# EasyEDA Pro project TJMakes_OLED.eprj

# Schematic schematic1
Create Date: 2024-02-23; Page Name: P1; Project Name: TJMakes_OLED; Schematic Name: schematic1; Update Date: 2024-02-26; Company: EasyEDA.com; Drawn: EasyEDA; Page Size: A4; Part Number: JLCPCB-002; Reviewed: EasyEDA; Version: V0.1
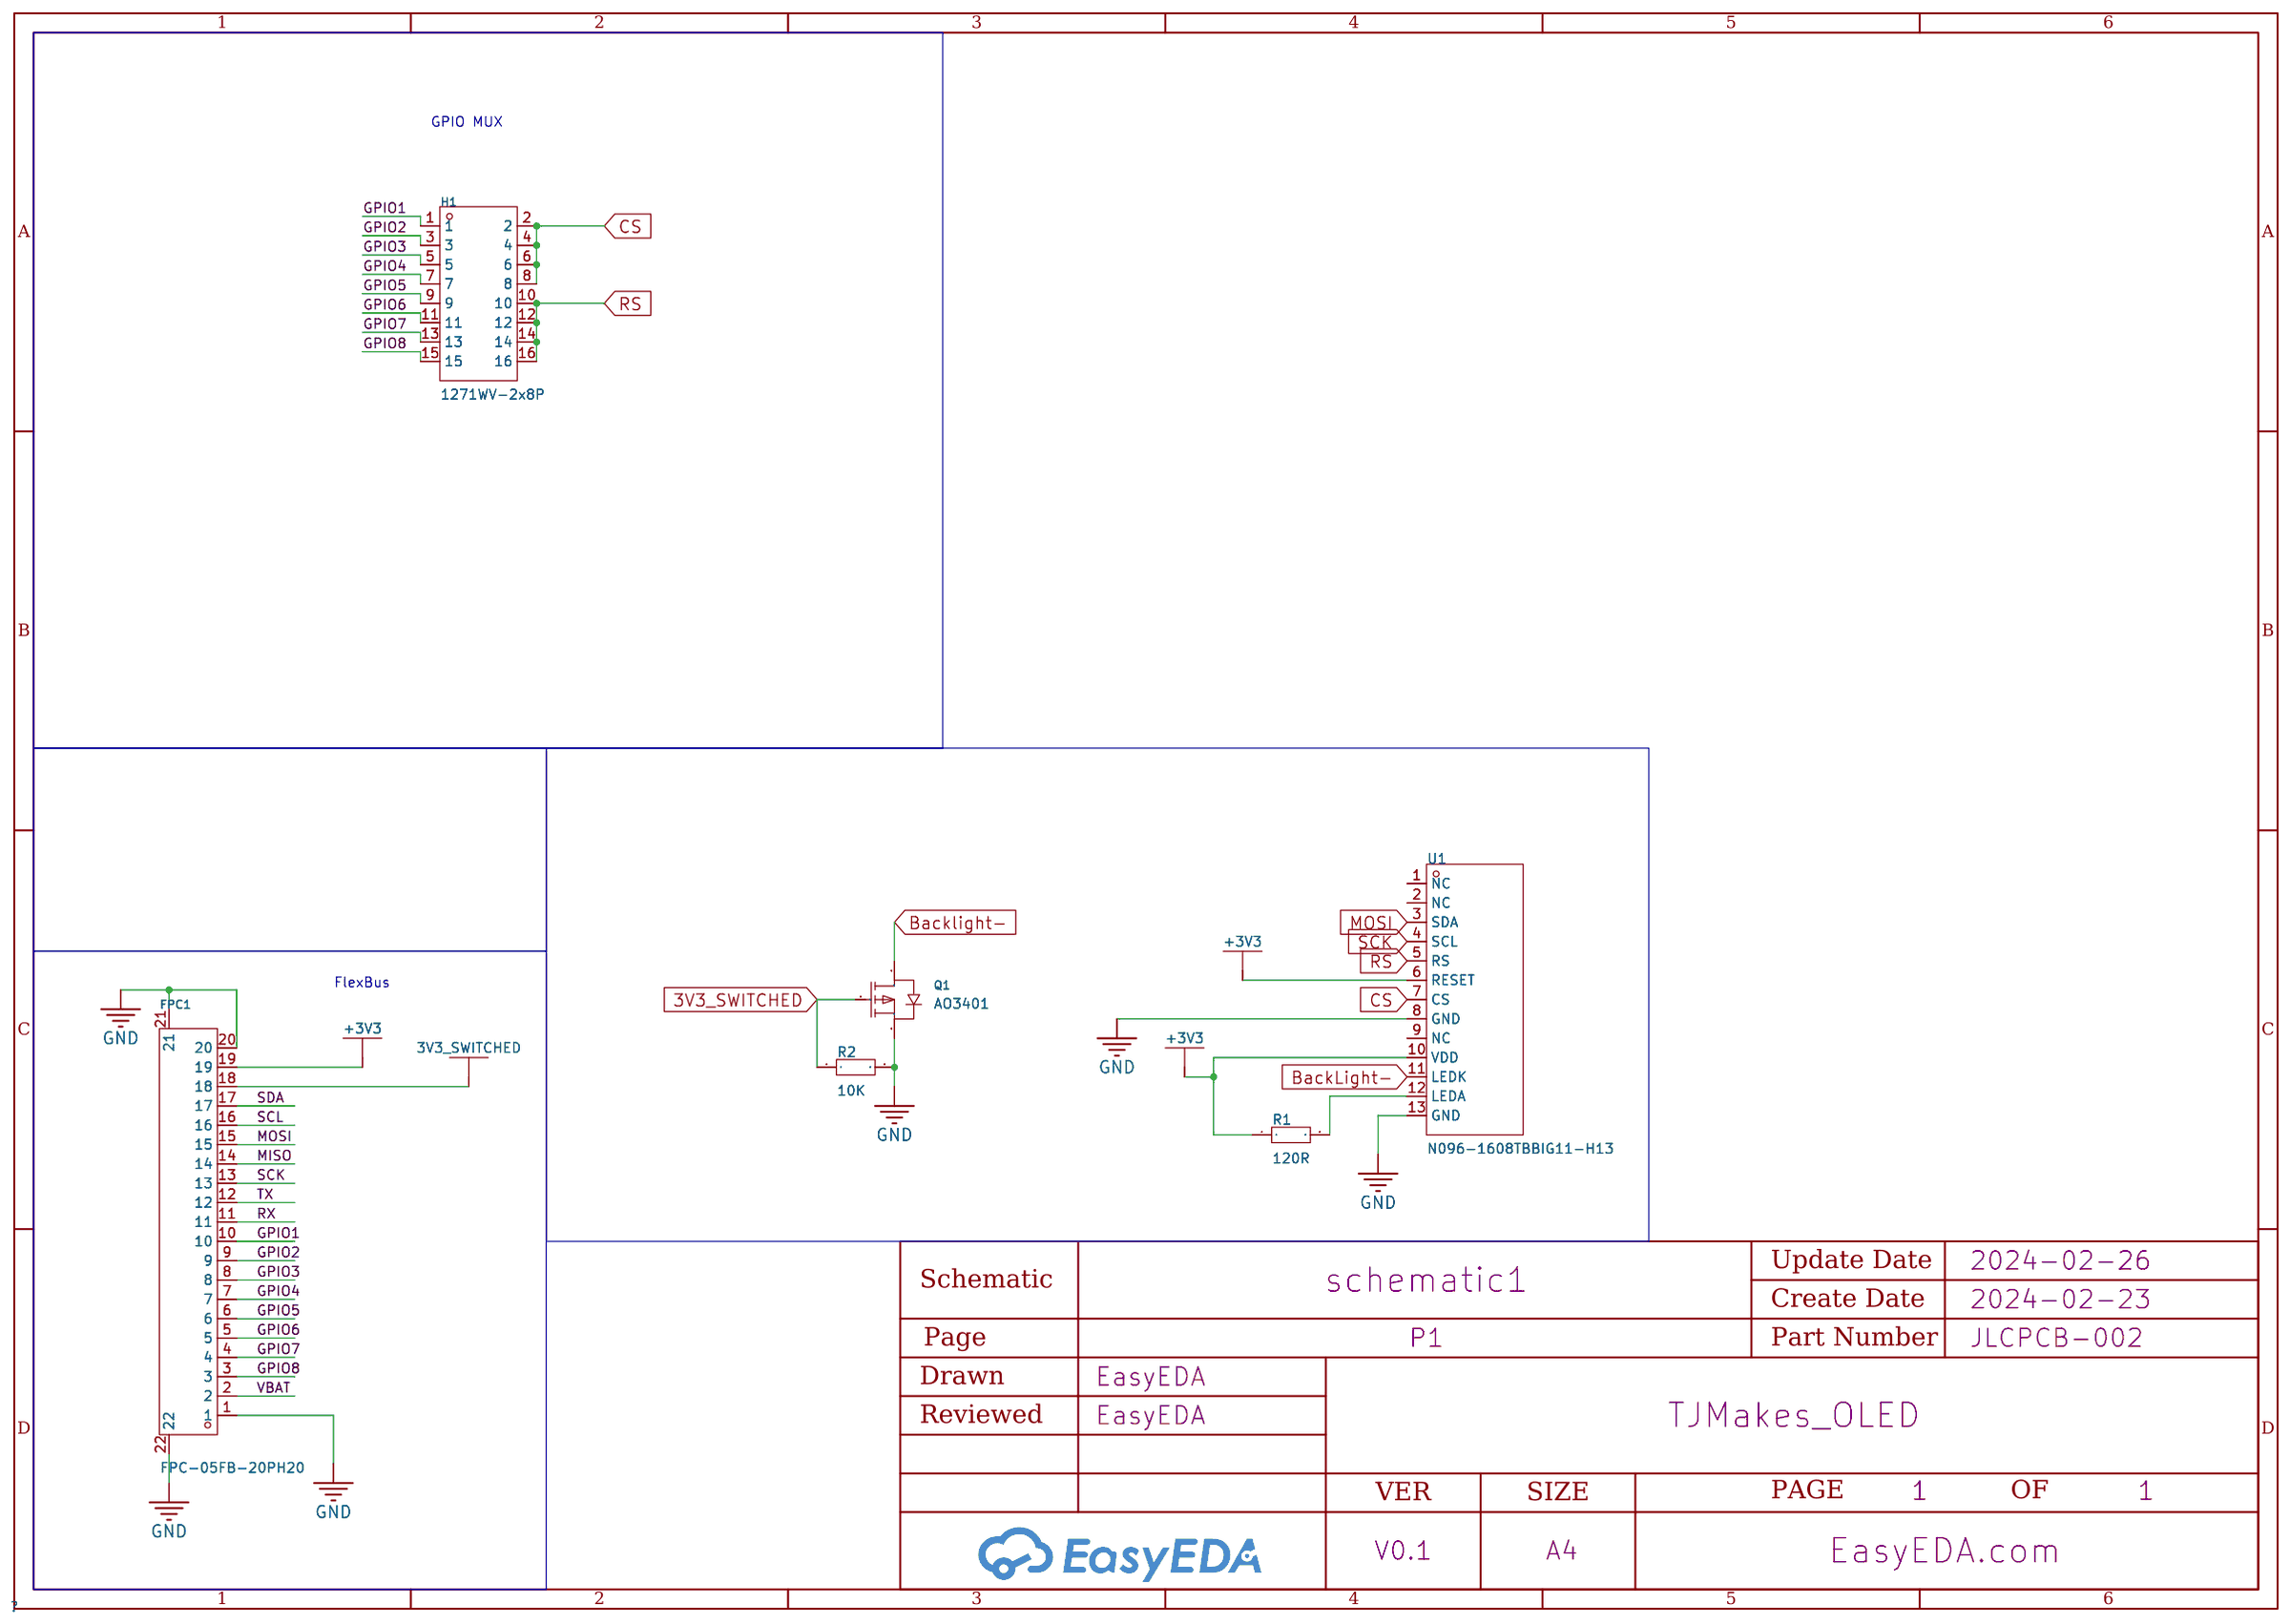
[diagram p0: schematic sheet]

## Parts
FPC1  FPC-05FB-20PH20  [FPC-SMD_20P-P0.50_FPC-05FB-20PH20]
H1  1271WV-2x8P  [HDR-TH_16P-P1.27-V-M-R2-C8-S1.27]
Q1  AO3401  [SOT-23-3_L2.9-W1.4-P1.90-LS2.6-BR]
R1  120R  [R0603]
R2  10K  [R0603]
U1  N096-1608TBBIG11-H13  [OLED-SMD_ST7735S]

## Library data of the parts
FPC1 = FPC-05FB-20PH20: Pitch:0.5mm Number of Contacts:20P Locking Feature:Clamshell FFC, FCB Thickness:0.3mm FFC, FCB Thickness:0.3mm Contact Type:Double-sided contacts/up and down connection Mounting Type:Surface Mount Height Above Board:2mm Operating Temperature Range:-25℃~+8; LCSC Part Name: 间距:0.5mm P数:20P 翻盖式 双侧触点/上下接; Supplier Part: C2856830; Manufacturer: XUNPU(讯普); Supplier Footprint: SMD,P=0.5mm,卧贴; JLCPCB Part Class: Extended Part; Datasheet: https://atta.szlcsc.com/upload/public/pdf/source/20210922/C2856830_32DC95BE77527398880E7D75F765EF2A.pdf; Supplier: LCSC; Pitch: 0.5mm; Number of Contacts: 20P; Locking Feature: Clamshell; FFC, FCB Thickness: 0.3mm; Contact Type: Double-sided contacts/up and down connection; Mounting Type: Surface Mount; Height Above Board: 2mm; Operating Temperature Range: -25℃~+85℃
H1 = KH-1.27PH180-2X8P-L7.2: Pin Structure:2x8P Pitch:1.27mm Row Spacing:1.27mm Circluar Pins/Square Pins:Square Pins Mounting Type:Straight Number of Rows:双排 Number of Pins:16P Current Rating (Max):1A Voltage Rating (Max):- Length of Mating Pin:3.9mm Insulation Height:1mm Length of; LCSC Part Name: 间距:1.27mm 2x8P 直插 方针; Supplier Part: C7470092; Manufacturer: kinghelm(金航标); Supplier Footprint: 插件,P=1.27mm; JLCPCB Part Class: Extended Part; Datasheet: https://atta.szlcsc.com/upload/public/pdf/source/20211228/40BBFCDE63818F8CDD890F8C15594070.pdf; Supplier: LCSC; Pin Structure: 2x8P; Pitch: 1.27mm; Row Spacing: 1.27mm; Circluar Pins/Square Pins: Square Pins; Mounting Type: Straight; Number of Rows: 双排; Number of Pins: 16P; Current Rating (Max): 1A; Length of Mating Pin: 3.9mm; Insulation Height: 1mm; Length of End Connection Pin: 2.3mm; Operating Temperature Range: -40℃~+105℃
Q1 = AO3401_C727156: Type: Drain Source Voltage (Vdss): Continuous Drain Current (Id): Power Dissipation (Pd): Drain Source On Resistance (RDS(on)@Vgs,Id):65mΩ@10V,4.2A Gate Threshold Voltage (Vgs(th)@Id):1.3V@250uA Total Gate Charge (Qg@Vgs):- Input Capacitance (Ciss@Vds):-; LCSC Part Name: P沟道 耐压:30V 电流:4.2A; Supplier Part: C727156; Manufacturer: TWGMC(台湾迪嘉); Supplier Footprint: SOT-23; JLCPCB Part Class: Extended Part; Datasheet: https://atta.szlcsc.com/upload/public/pdf/source/20200827/C727156_6E081BBEEFBC6B8FEE164CB196B0AF30.pdf; Supplier: LCSC; Drain Source On Resistance (RDS(on)@Vgs,Id): 65mΩ@10V,4.2A; Gate Threshold Voltage (Vgs(th)@Id): 1.3V@250uA
R1 R2 = Res_0603: Supplier Footprint: 0603
U1 = N096-1608TBBIG11-H13: Main Control Chip:ST7735S Size:0.96; LCSC Part Name: 0.96寸 13PIN TFT显示模块; Supplier Part: C2890616; Manufacturer: Newvision(新智景); JLCPCB Part Class: Extended Part; Datasheet: https://atta.szlcsc.com/upload/public/pdf/source/20231226/547EDAFF24C26DAA822C226E12BDC601.pdf; Supplier: LCSC; Main Control Chip: ST7735S; Size: 0.96

## Nets
3V3_SWITCHED: FPC1.18 Q1.1(G) R2.1
+3V3: FPC1.19 R1.1 U1.6(RESET) U1.10(VDD)
GND: FPC1.1 FPC1.20 FPC1.21 FPC1.22 Q1.2(S) R2.2 U1.8(GND) U1.13(GND)
VBAT: FPC1.2
BackLight-: U1.11(LEDK)
Backlight-: Q1.3(D)
CS: H1.2 H1.4 H1.6 H1.8 U1.7(CS)
GPIO1: FPC1.10 H1.1
GPIO2: FPC1.9 H1.3
GPIO3: FPC1.8 H1.5
GPIO4: FPC1.7 H1.7
GPIO5: FPC1.6 H1.9
GPIO6: FPC1.5 H1.11
GPIO7: FPC1.4 H1.13
GPIO8: FPC1.3 H1.15
MISO: FPC1.14
MOSI: FPC1.15 U1.3(SDA)
RS: H1.10 H1.12 H1.14 H1.16 U1.5(RS)
RX: FPC1.11
SCK: FPC1.13 U1.4(SCL)
SCL: FPC1.16
SDA: FPC1.17
TX: FPC1.12
$1N10722: R1.2 U1.12(LEDA)

Not connected (* = marked no-connect by the designer): U1 1(NC) 2(NC) 9(NC)

## Notes on the sheet
- GPIO MUX
- FlexBus

# Board PCB1
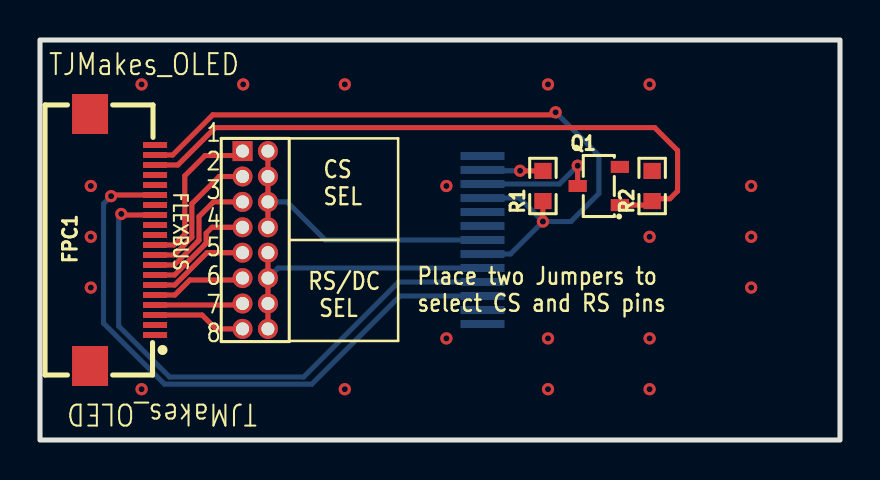
[diagram p1: board, top side]
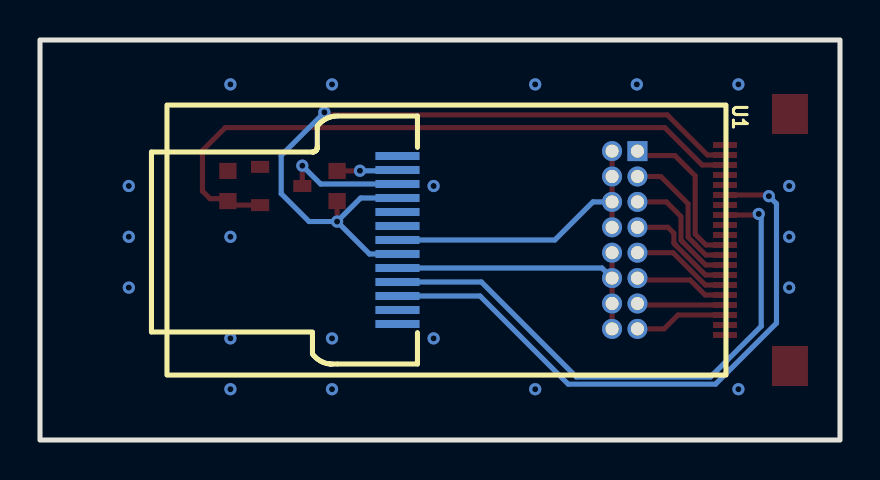
[diagram p2: board, bottom side, seen from below]

Outline 40 x 20 mm; copper layers: Top Layer, Bottom Layer. Coordinates in mm from the lower left corner of the outline.
Outline path: rectangle 0,20 40,0
Stack: Top Layer 0.035mm / Dielectric1 1.51mm FR4 er 4.5 / Bottom Layer 0.035mm

## Design rules (mm)
template: JLCPCB Capability(Two Layers Board)
spacing copperThickness1oz (default): track to track 0.102, other pairs 0.152 to 0.3
spacing copperThickness2oz: track to track 0.203, other pairs 0.152 to 0.3
track width copperThickness1oz (default): min 0.127, default 0.254, max 2.54
track width copperThickness2oz: min 0.203, default 0.254, max 2.54
differential pair differentialPair (default): width min 0.127, default 0.254, max 2.54; gap min 0.152, default 0.152
via viaSize (default): diameter min 0.5, default 0.61, max 10; hole min 0.3, default 0.305, max 6.3

## Placement (name value [footprint] x y rotation side)
FPC1  FPC-05FB-20PH20  [FPC-SMD_20P-P0.50_FPC-05FB-20PH20]  4.13 10 270 top
H1  1271WV-2x8P  [HDR-TH_16P-P1.27-V-M-R2-C8-S1.27]  10.76 10 270 top
Q1  AO3401  [SOT-23-3_L2.9-W1.4-P1.90-LS2.6-BR]  27.94 12.7 0 top
R1  120R  [R0603]  25.15 12.7 90 top
R2  10K  [R0603]  30.61 12.7 90 top
U1  N096-1608TBBIG11-H13  [OLED-SMD_ST7735S]  22.13 10 270 bottom

## Footprints (pads in the part's own frame, mm; a bottom-side part is the same pattern mirrored in y, then rotated)
FPC-SMD_20P-P0.50_FPC-05FB-20PH20
  rect 0.3x1.2 smd: 1(4.75,1.625) 2(4.25,1.625) 3(3.75,1.625) 4(3.25,1.625) 5(2.75,1.625) 6(2.25,1.625) 7(1.75,1.625) 8(1.25,1.625) 9(0.75,1.625) 10(0.25,1.625) 11(-0.25,1.625) 12(-0.75,1.625) 13(-1.25,1.625) 14(-1.75,1.625) 15(-2.25,1.625) 16(-2.75,1.625) 17(-3.25,1.625) 18(-3.75,1.625) 19(-4.25,1.625) 20(-4.75,1.625)
  rect 2x1.8 smd: 21(-6.3,-1.625) 22(6.3,-1.625)
HDR-TH_16P-P1.27-V-M-R2-C8-S1.27
  rect 1x1 hole 0.65: 1(-4.445,-0.635)
  round 1 hole 0.65: 2(-4.445,0.635) 3(-3.175,-0.635) 4(-3.175,0.635) 5(-1.905,-0.635) 6(-1.905,0.635) 7(-0.635,-0.635) 8(-0.635,0.635) 9(0.635,-0.635) 10(0.635,0.635) 11(1.905,-0.635) 12(1.905,0.635) 13(3.175,-0.635) 14(3.175,0.635) 15(4.445,-0.635) 16(4.445,0.635)
OLED-SMD_ST7735S
  rect 0.4x2.2 smd: 1(4.2,0) 2(3.5,0) 3(2.8,0) 4(2.1,0) 5(1.4,0) 6(0.7,0) 7(0,0) 8(-0.7,0) 9(-1.4,0) 10(-2.1,0) 11(-2.8,0) 12(-3.5,0) 13(-4.2,0)
R0603
  rect 0.806x0.864 smd: 1(-0.753,0) 2(0.753,0)
SOT-23-3_L2.9-W1.4-P1.90-LS2.6-BR
  rect 0.91x0.6 smd: 1(1.055,-0.955) 2(1.055,0.955) 3(-1.055,0)

## Nets
As in the schematic, except:
BACKLIGHT-: Q1.3 U1.11

Pads without a net: U1 1 2 9

## Via types
v1: diameter 0.61, hole 0.304, Top Layer to Bottom Layer, 20 vias
v2: diameter 0.61, hole 0.305, Top Layer to Bottom Layer, 6 vias

## Routing (per net, layer and track width the routed paths; a pad name or vN(x,y) marks a point on that pad's centre or on a via; arc(x,y) is an arc through that point)
3V3_SWITCHED: length 32.6
  Top Layer w0.254: Q1.1 30.41,11.75 R2.1 30.73,12.06 31.5,12.06 31.88,12.45 31.88,14.48 30.73,15.62 8.76,15.62 6.89,13.75 FPC1.18
+3V3: length 37.5
  Top Layer w0.254: v2(25.78,16.38) 25.65,16.26 8.64,16.26 6.63,14.25 FPC1.19 ; R1.1 v2(25.15,10.92)
  Bottom Layer w0.254: U1.10 23.97,12.1 v2(25.15,10.92) ; v2(25.15,10.92) 23.52,9.3 U1.6 ; v2(25.15,10.92) 26.54,10.92 27.94,12.32 27.94,14.22 v2(25.78,16.38)
GND:
  vias: v1(2.54,12.7) v1(2.54,10.16) v1(2.54,7.62) v1(5.08,17.78) v1(5.08,2.54) v1(10.16,17.78) v1(15.24,17.78) v1(15.24,2.54) v1(20.32,12.7) v1(20.32,5.08) v1(25.4,17.78) v1(25.4,5.08) v1(25.4,2.54) v1(30.48,17.78) v1(30.48,10.16) v1(30.48,5.08) v1(30.48,2.54) v1(35.56,12.7) v1(35.56,10.16) v1(35.56,7.62)
BACKLIGHT-: length 6.2
  Top Layer w0.254: Q1.3 v2(26.89,13.72)
  Bottom Layer w0.254: U1.11 25.97,12.8 v2(26.89,13.72)
CS: length 15.3
  Top Layer w0.254: H1.2 H1.4 H1.6 H1.8
  Bottom Layer w0.254: H1.6 12.35,11.91 14.26,10 U1.7
GPIO1: length 8
  Top Layer w0.254: FPC1.10 6.7,9.75 7.24,10.29 7.24,13.21 8.25,14.22 9.91,14.22 H1.1
GPIO2: length 7
  Top Layer w0.254: FPC1.9 6.71,9.25 7.24,9.78 7.24,9.78 7.59,10.14 7.59,11.81 8.96,13.17 H1.3
GPIO3: length 6.4
  Top Layer w0.254: FPC1.8 6.72,8.75 7.87,9.91 7.87,9.92 7.95,9.99 7.95,11.18 8.68,11.91 H1.5
GPIO4: length 5.7
  Top Layer w0.254: FPC1.7 6.73,8.25 8.23,9.75 8.23,9.77 8.31,9.84 8.31,10.34 8.6,10.64 H1.7
GPIO5: length 5
  Top Layer w0.254: H1.9 8.35,9.36 6.73,7.75 FPC1.6
GPIO6: length 4.7
  Top Layer w0.254: FPC1.5 6.74,7.25 7.49,8 10.03,8 H1.11
GPIO7: length 4.4
  Top Layer w0.254: FPC1.4 10.05,6.75 H1.13
GPIO8: length 4.7
  Top Layer w0.254: FPC1.3 8.1,6.25 8.8,5.56 H1.15
MOSI: length 30.8
  Top Layer w0.254: v2(3.56,12.19) 3.61,12.25 FPC1.15
  Bottom Layer w0.254: v2(3.56,12.19) 3.18,11.81 3.18,5.84 6.22,2.79 13.59,2.79 18,7.2 U1.3
RS: length 14.9
  Top Layer w0.254: H1.10 H1.12 H1.14 H1.16 11.3,5.46
  Bottom Layer w0.254: H1.12 11.9,8.6 U1.5
SCK: length 28.6
  Top Layer w0.254: v2(4.06,11.3) 4.12,11.25 FPC1.13
  Bottom Layer w0.254: U1.4 17.93,7.9 13.18,3.15 6.48,3.15 3.94,5.69 3.94,11.18 v2(4.06,11.3)
$1N10722: length 3
  Top Layer w0.254: R1.2 24.01,13.45 v2(24,13.46)
  Bottom Layer w0.254: U1.12 22.17,13.46 v2(24,13.46)

## Copper pours and planes (outline as drawn; the poured copper is in the pictures)
GND on Top Layer: 0,20 40,20 40,0 0,0
GND on Bottom Layer: 0,20 40,20 40,0 0,0

## Text on the board
Top Silkscreen Layer: FLEXBUS | RS/DC / SEL | CS / SEL | Place two Jumpers to / select CS and RS pins | 1 / 2 / 3 / 4 / 5 / 6 / 7 / 8 | TJMakes_OLED
